# EAGLE design PiedPiper (EAGLE 9.5.1)
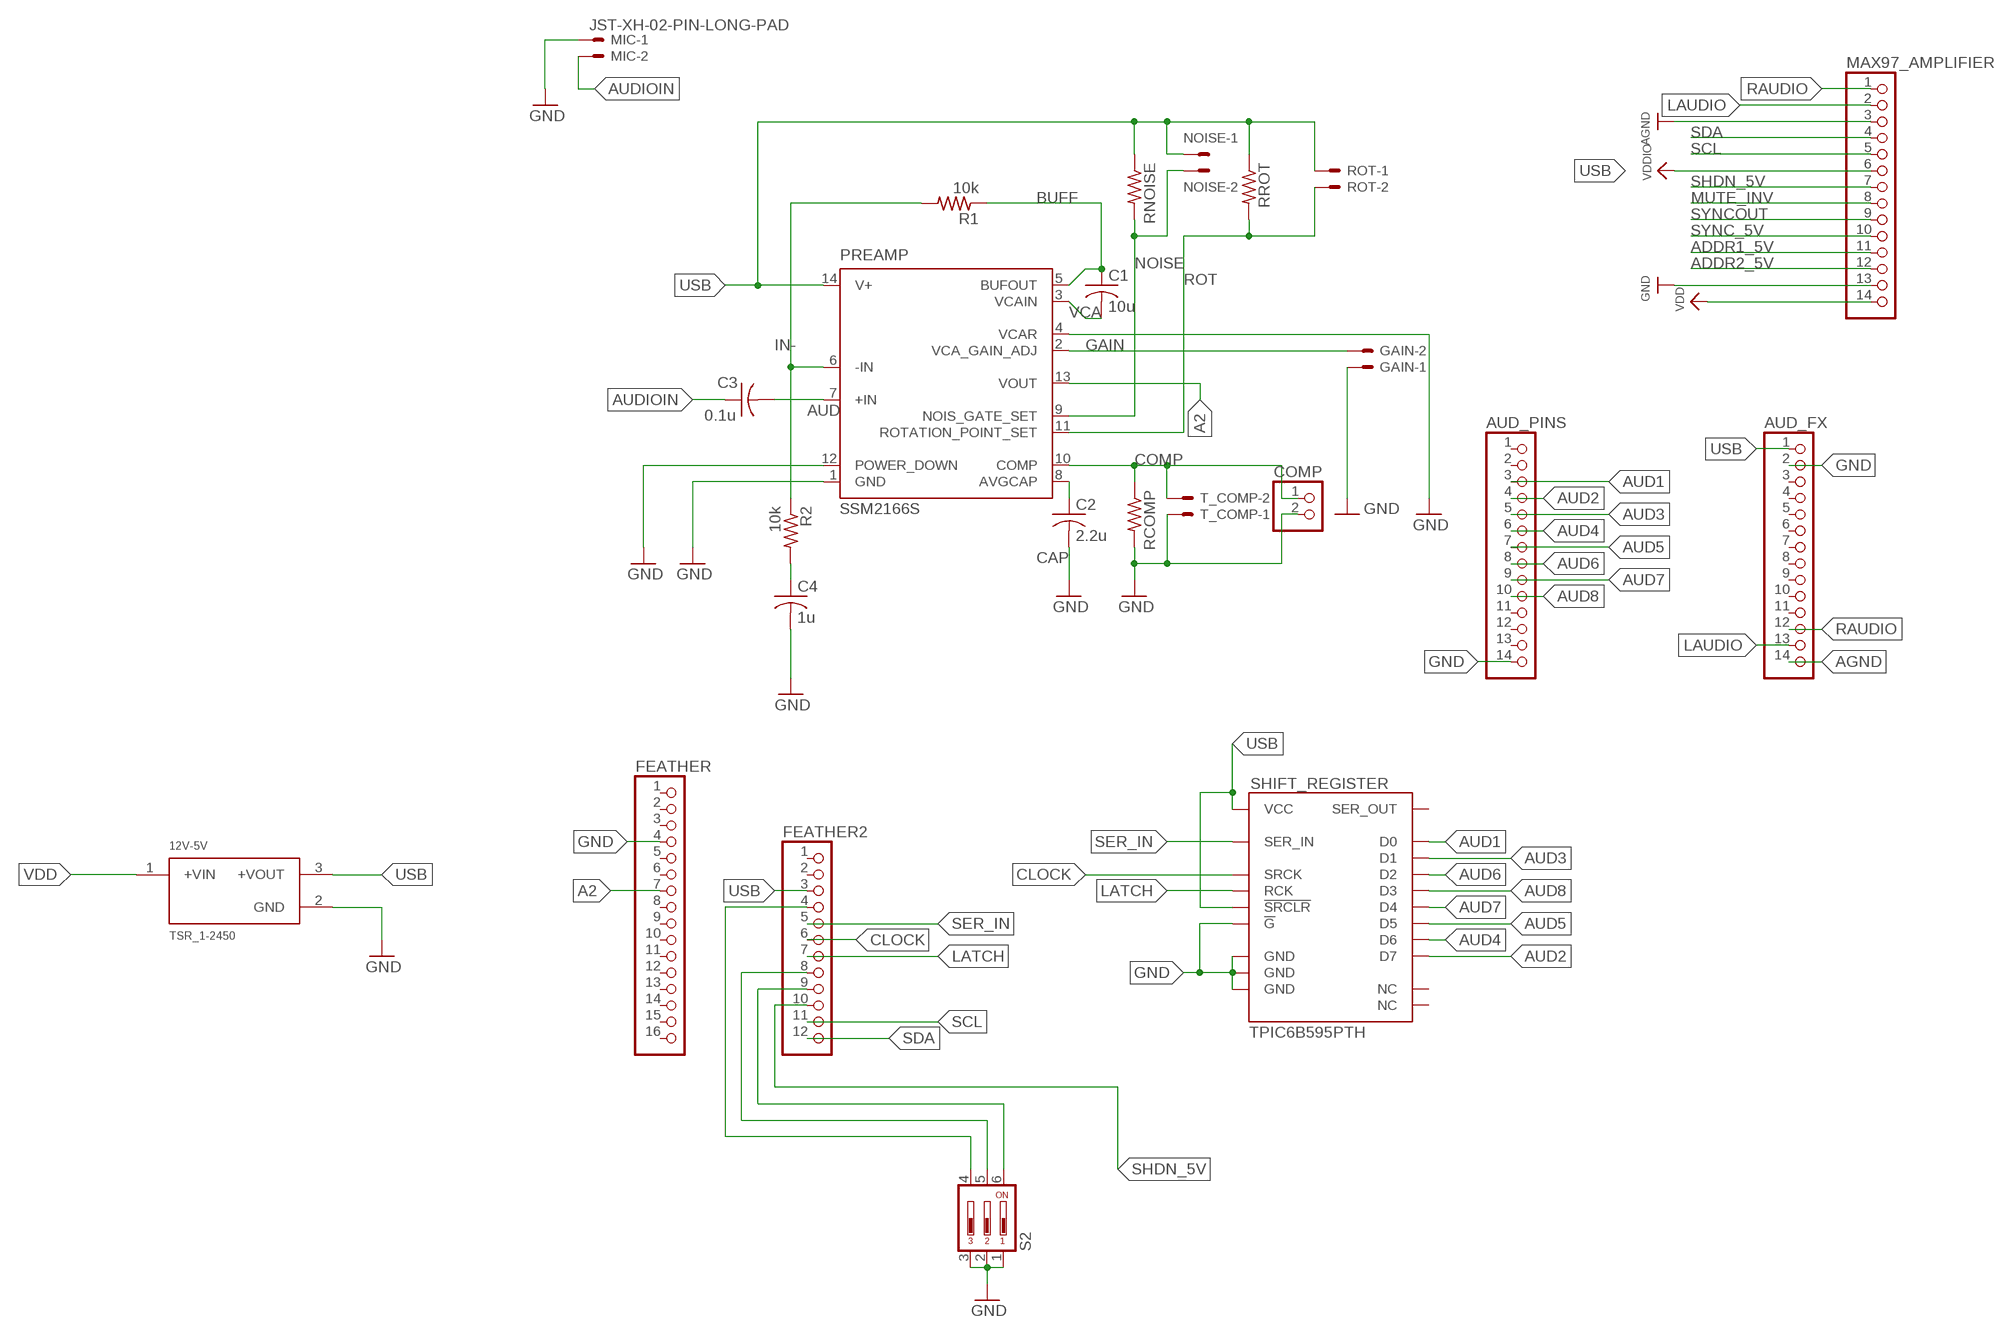
[diagram p0: schematic, sheet 1]

## Parts
12V-5V  TSR_1-2450  [CONV_TSR_1-2450]
AUD_FX  PINHD-1X14  [1X14]
AUD_PINS  PINHD-1X14  [1X14]
C1  10u  C-USC0805  [C0805]
C2  2.2u  C-USC0805  [C0805]
C3  0.1u  C-USC0805  [C0805]
C4  1u  C-USC0805  [C0805]
COMP  PINHD-1X2  [1X02]
FEATHER  PINHD-1X16  [1X16]
FEATHER2  PINHD-1X12  [1X12]
GAIN  JST-XH-02-PIN-LONG-PAD  [JST-XH-02-PACKAGE-LONG-PAD]
MAX97_AMPLIFIER  HEADER-1X14  [1X14_ROUND70]
MIC  JST-XH-02-PIN-LONG-PAD  [JST-XH-02-PACKAGE-LONG-PAD]
NOISE  JST-XH-02-PIN-LONG-PAD  [JST-XH-02-PACKAGE-LONG-PAD]
PREAMP  SSM2166S  [SO14]
R1  10k  R-US_R1206  [R1206]
R2  10k  R-US_R1206  [R1206]
RCOMP  R-US_R1206  [R1206]
RNOISE  R-US_R1206  [R1206]
ROT  JST-XH-02-PIN-LONG-PAD  [JST-XH-02-PACKAGE-LONG-PAD]
RROT  R-US_R1206  [R1206]
S2  DP03  [DP-03]
SHIFT_REGISTER  TPIC6B595PTH  [DIL20]
T_COMP  JST-XH-02-PIN-LONG-PAD  [JST-XH-02-PACKAGE-LONG-PAD]

## Nets
A2: FEATHER.7 PREAMP.13(VOUT)
ADDR1_5V: MAX97_AMPLIFIER.11
ADDR2_5V: MAX97_AMPLIFIER.12
AGND: AUD_FX.14 MAX97_AMPLIFIER.3
AUD: C3.2 PREAMP.7(+IN)
AUD1: AUD_PINS.3 SHIFT_REGISTER.4(D0)
AUD2: AUD_PINS.4 SHIFT_REGISTER.17(D7)
AUD3: AUD_PINS.5 SHIFT_REGISTER.5(D1)
AUD4: AUD_PINS.6 SHIFT_REGISTER.16(D6)
AUD5: AUD_PINS.7 SHIFT_REGISTER.15(D5)
AUD6: AUD_PINS.8 SHIFT_REGISTER.6(D2)
AUD7: AUD_PINS.9 SHIFT_REGISTER.14(D4)
AUD8: AUD_PINS.10 SHIFT_REGISTER.7(D3)
AUDIOIN: C3.1 MIC.2
BUFF: C1.1 PREAMP.5(BUFOUT) R1.1
CAP: C2.1 PREAMP.8(AVGCAP)
CLOCK: FEATHER2.6 SHIFT_REGISTER.13(SRCK)
COMP: COMP.1 PREAMP.10(COMP) RCOMP.1 T_COMP.2
GAIN: GAIN.2 PREAMP.2(VCA_GAIN_ADJ)
GND: 12V-5V.2(GND) AUD_FX.2 AUD_PINS.14 C2.2 C4.2 COMP.2 FEATHER.4 GAIN.1 MAX97_AMPLIFIER.13 MIC.1 PREAMP.1(GND) PREAMP.4(VCAR) PREAMP.12(POWER_DOWN) RCOMP.2 S2.1 S2.2 S2.3 SHIFT_REGISTER.9(!G) SHIFT_REGISTER.10(GND) SHIFT_REGISTER.11(GND) SHIFT_REGISTER.19(GND) T_COMP.1
IN-: PREAMP.6(-IN) R1.2 R2.1
LATCH: FEATHER2.7 SHIFT_REGISTER.12(RCK)
LAUDIO: AUD_FX.13 MAX97_AMPLIFIER.2
MUTE_INV: MAX97_AMPLIFIER.8
N$1: FEATHER2.8 S2.5
N$3: FEATHER2.9 S2.6
N$4: FEATHER2.4 S2.4
N$15: C4.1 R2.2
NOISE: NOISE.2 PREAMP.9(NOIS_GATE_SET) RNOISE.2
RAUDIO: AUD_FX.12 MAX97_AMPLIFIER.1
ROT: PREAMP.11(ROTATION_POINT_SET) ROT.2 RROT.2
SCL: FEATHER2.11 MAX97_AMPLIFIER.5
SDA: FEATHER2.12 MAX97_AMPLIFIER.4
SER_IN: FEATHER2.5 SHIFT_REGISTER.3(SER_IN)
SHDN_5V: FEATHER2.10 MAX97_AMPLIFIER.7
SYNC_5V: MAX97_AMPLIFIER.10
SYNCOUT: MAX97_AMPLIFIER.9
USB: 12V-5V.3(+VOUT) AUD_FX.1 FEATHER2.3 MAX97_AMPLIFIER.6 NOISE.1 PREAMP.14(V+) RNOISE.1 ROT.1 RROT.1 SHIFT_REGISTER.2(VCC) SHIFT_REGISTER.8(!SRCLR) ; supply symbol labelled VDDIO
VCA: C1.2 PREAMP.3(VCAIN)
VDD: 12V-5V.1(+VIN) MAX97_AMPLIFIER.14
Unconnected: AUD_FX.3 AUD_FX.4 AUD_FX.5 AUD_FX.6 AUD_FX.7 AUD_FX.8 AUD_FX.9 AUD_FX.10 AUD_FX.11 AUD_PINS.1 AUD_PINS.2 AUD_PINS.11 AUD_PINS.12 AUD_PINS.13 FEATHER2.1 FEATHER2.2 FEATHER.1 FEATHER.2 FEATHER.3 FEATHER.5 FEATHER.6 FEATHER.8 FEATHER.9 FEATHER.10 FEATHER.11 FEATHER.12 FEATHER.13 FEATHER.14 FEATHER.15 FEATHER.16 SHIFT_REGISTER.1(NC) SHIFT_REGISTER.18(SER_OUT) SHIFT_REGISTER.20(NC)

## Library data of the parts
12V-5V = TSR_1-2450:TSR_1-2450: Linear Regulator Replacement DC DC Converter 1 Output 12V 1A 15V - 36V Input; AVAILABILITY: Unavailable; DESCRIPTION: Linear Regulator Replacement DC DC Converter 1 Output 5V 1A 6.5V - 36V Input; MF: Traco Power; MP: TSR 1-2450; PACKAGE: SIP-3 Tracopower; PRICE: None
AUD_FX AUD_PINS = pinhead:PINHD-1X14: PIN HEADER
C1-C4 = rcl:C-US: CAPACITOR, American symbol; SPICEPREFIX: C
COMP = pinhead:PINHD-1X2: PIN HEADER
FEATHER = pinhead:PINHD-1X16: PIN HEADER
FEATHER2 = pinhead:PINHD-1X12: PIN HEADER
GAIN MIC NOISE ROT T_COMP = Rembrandt Electronics - JST XH Connectors v1-0:JST-XH-02-PIN: JST XH Connector 2 Pin Wire to board connector. Pitch: 2,54 mm, (0.100") Number of pins: 2 Created by Rembrandt Electronics www.rembrandtelectronics.com
MAX97_AMPLIFIER = microbuilder:HEADER-1X14
PREAMP = SSM2166:SSM2166: Microphone Preamplifier with Variable Compression and Noise Gating Source: http://www.analog.com/static/imported-files/data_sheets/SSM2166.pdf; AVAILABILITY: Unavailable; DESCRIPTION: ADI MICROPHONE PREAMP W/VAR COMPRESS; MF: Analog Devices; MP: SSM2166; PACKAGE: None; PRICE: None
R1 R2 RCOMP RNOISE RROT = rcl:R-US_: RESISTOR, American symbol; SPICEPREFIX: R
S2 = switch-dil:DP03: DIL/CODE SWITCH; MPN: MCDP03; OC_FARNELL: 1522004; OC_NEWARK: 74M2976
SHIFT_REGISTER = TPIC6B595:TPIC6B595; AVAILABILITY: Unavailable; DESCRIPTION: Integrated Circuit; MF: Texas Instruments; MP: TPIC6B595; PACKAGE: SOIC-20 Texas Instruments; PRICE: None

## Board
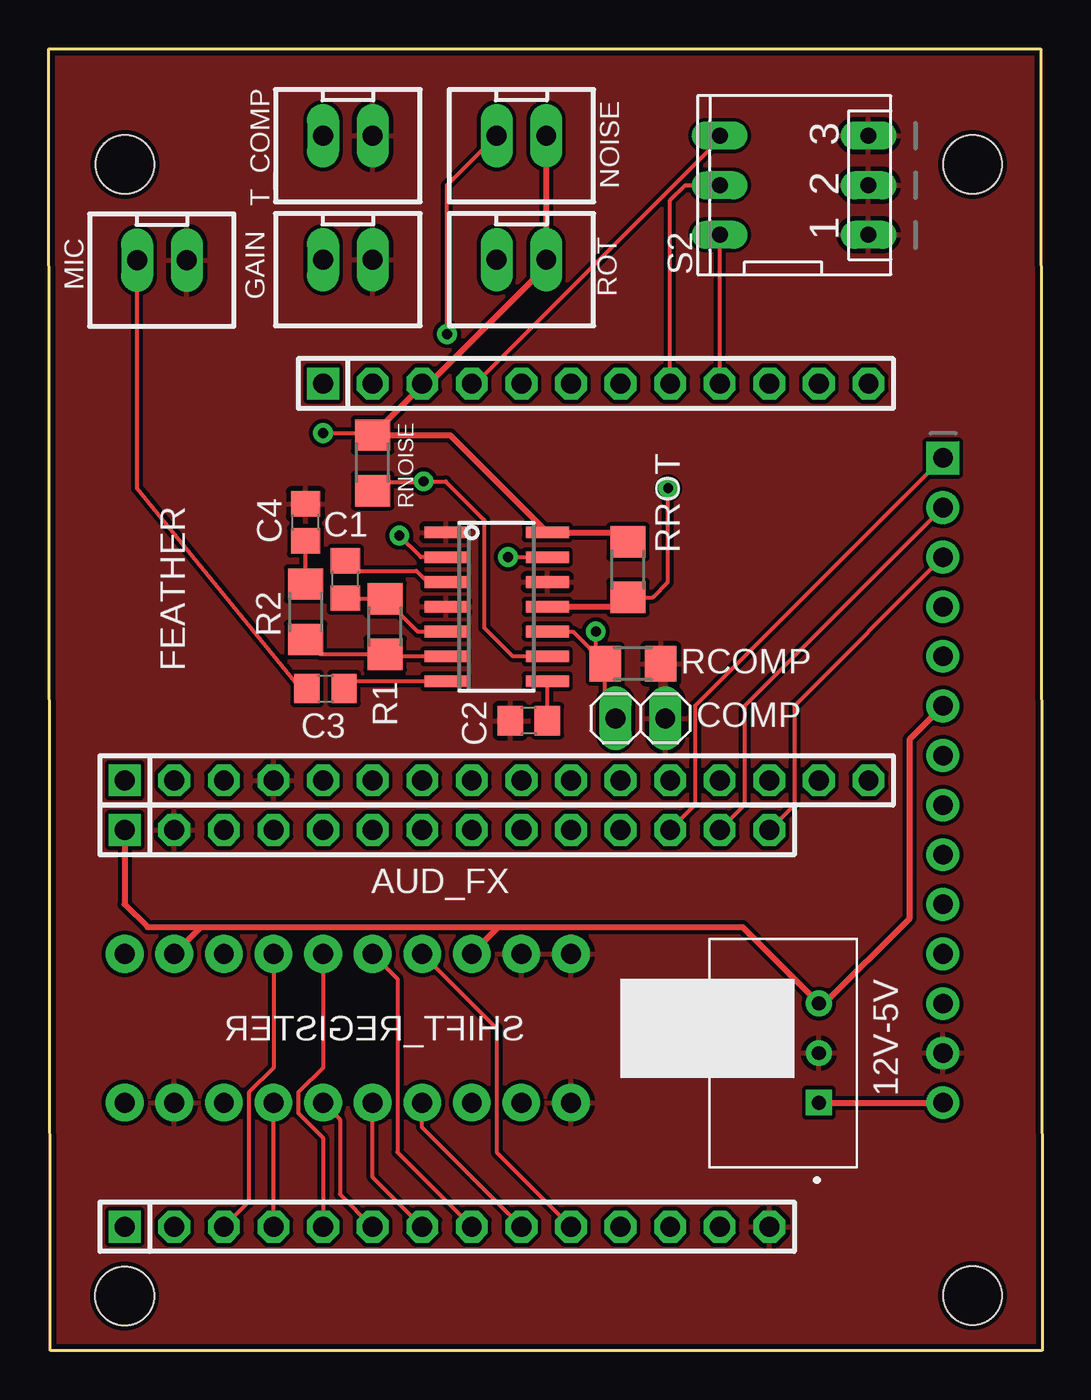
[diagram p1: board, top side]
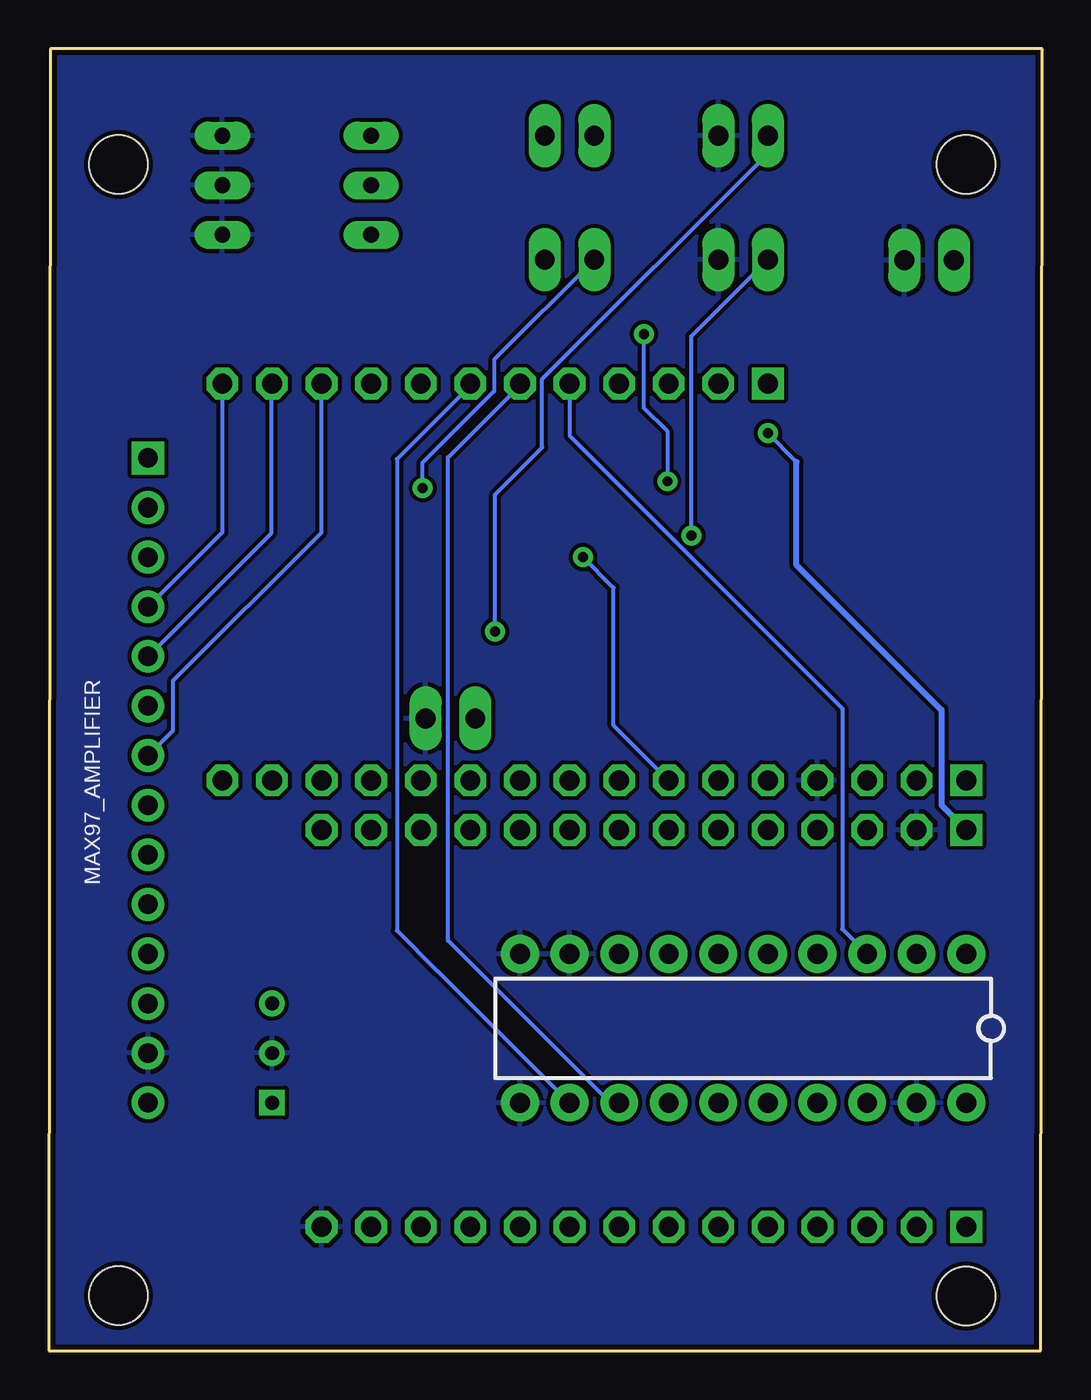
[diagram p2: board, bottom side, seen from below]

Size 50.88 x 66.68 mm. Coordinates in mm from the lower left corner, seen from the top.
Outline: 0,66.68 50.8,66.68 50.88,0 0.08,0 0,66.68
Copper layers (1*16): Top 0.035mm / dielectric 1.5mm / Bottom 0.035mm
Design rules "SparkFun": minimum track width 8mil, minimum drill 20mil, track to track 8mil, track to pad 8mil, pad to pad 8mil, via to via 8mil, smd to smd 8mil, copper to edge 10mil, drill to drill 8mil, minimum pad ring 12mil, minimum via ring 10mil, stop-mask expansion 4mil, vias tented up to drill 25mil, thermal gap 10mil
Holes 3 mm at 47.32,2.82 3.89,2.79 3.9,60.76 47.31,60.75

### Footprints (pad centres in the part's own frame; a part is rotated, then mirrored left to right if it is on the bottom)
CONV_TSR_1-2450 = drill 0.71 pad 1.11 square: 1 -2.54,0 | drill 0.71 pad 1.11: 2 0,0; 3 2.54,0
1X14 = drill 1.016 square: 1 -16.51,0 | drill 1.016 octagon: 2 -13.97,0; 3 -11.43,0; 4 -8.89,0; 5 -6.35,0; 6 -3.81,0; 7 -1.27,0; 8 1.27,0; 9 3.81,0; 10 6.35,0; 11 8.89,0; 12 11.43,0; 13 13.97,0; 14 16.51,0
C0805 = smd 1.3 x 1.5: 1 -0.95,0; 2 0.95,0
1X02 = drill 1.016 long: 1 -1.27,0; 2 1.27,0
1X16 = drill 1.016 square: 1 -19.05,0 | drill 1.016 octagon: 2 -16.51,0; 3 -13.97,0; 4 -11.43,0; 5 -8.89,0; 6 -6.35,0; 7 -3.81,0; 8 -1.27,0; 9 1.27,0; 10 3.81,0; 11 6.35,0; 12 8.89,0; 13 11.43,0; 14 13.97,0; 15 16.51,0; 16 19.05,0
1X12 = drill 1.016 square: 1 -13.97,0 | drill 1.016 octagon: 2 -11.43,0; 3 -8.89,0; 4 -6.35,0; 5 -3.81,0; 6 -1.27,0; 7 1.27,0; 8 3.81,0; 9 6.35,0; 10 8.89,0; 11 11.43,0; 12 13.97,0
JST-XH-02-PACKAGE-LONG-PAD = drill 1.016 long: 1 -1.27,0; 2 1.27,0
1X14_ROUND70 = drill 1 pad 1.676 square: 1 -16.51,0 | drill 1 pad 1.676: 2 -13.97,0; 3 -11.43,0; 4 -8.89,0; 5 -6.35,0; 6 -3.81,0; 7 -1.27,0; 8 1.27,0; 9 3.81,0; 10 6.35,0; 11 8.89,0; 12 11.43,0; 13 13.97,0; 14 16.51,0
SO14 = smd 0.6 x 2.2: 1 -3.81,-2.6; 2 -2.54,-2.6; 3 -1.27,-2.6; 4 0,-2.6; 5 1.27,-2.6; 6 2.54,-2.6; 7 3.81,-2.6; 8 3.81,2.6; 9 2.54,2.6; 10 1.27,2.6; 11 0,2.6; 12 -1.27,2.6; 13 -2.54,2.6; 14 -3.81,2.6
R1206 = smd 1.6 x 1.803: 1 -1.422,0; 2 1.422,0
DP-03 = drill 0.813 long: 1 -2.54,-3.81; 2 0,-3.81; 3 2.54,-3.81; 4 2.54,3.81; 5 0,3.81; 6 -2.54,3.81
DIL20 = drill 1.016 pad 1.93: 1 -11.43,-3.81; 2 -8.89,-3.81; 3 -6.35,-3.81; 4 -3.81,-3.81; 5 -1.27,-3.81; 6 1.27,-3.81; 7 3.81,-3.81; 8 6.35,-3.81; 9 8.89,-3.81; 10 11.43,-3.81; 11 11.43,3.81; 12 8.89,3.81; 13 6.35,3.81; 14 3.81,3.81; 15 1.27,3.81; 16 -1.27,3.81; 17 -3.81,3.81; 18 -6.35,3.81; 19 -8.89,3.81; 20 -11.43,3.81

### Placement (x,y rotation side)
12V-5V  39.45,15.24 90 top
AUD_FX  20.4,26.67 0 top
AUD_PINS  20.4,6.35 0 top
C1  15.19,39.5 90 top
C2  24.59,32.26 180 top
C3  14.17,33.91 0 top
C4  13.16,42.42 90 top
COMP  30.3,32.38 0 top
FEATHER  22.94,29.21 0 top
FEATHER2  28.02,49.53 0 top
GAIN  15.32,55.88 180 top
MAX97_AMPLIFIER  45.8,29.21 270 top
MIC  5.79,55.85 180 top
NOISE  24.21,62.23 180 top
PREAMP  22.94,38.1 270 top
R1  17.22,37.08 270 top
R2  13.16,37.85 90 top
RCOMP  29.92,35.18 0 top
RNOISE  16.59,45.47 270 top
ROT  24.21,55.88 180 top
RROT  29.67,40.01 270 top
S2  38.18,59.69 90 top
SHIFT_REGISTER  15.32,16.51 180 bottom
T_COMP  15.32,62.23 180 top

### Tracks (layer width: path | path; a pad name or v marks a point on that pad's centre or on a via)
A2  (via drill 0.51)
  Top 0.203: v23.52,40.64 PREAMP.13
  Bottom 0.203: FEATHER.7 21.95,32.03 21.95,39.07 v23.52,40.64
AGND
  Top 0.203: AUD_FX.14 38.18,27.94 38.18,33.02 MAX97_AMPLIFIER.3
AUD
  Top 0.203: C3.2 15.12,34.16 15,34.29 PREAMP.7
AUD1
  Top 0.203: SHIFT_REGISTER.4 11.51,14.5 10.24,13.23 10.24,7.62 AUD_PINS.3
AUD2
  Top 0.203: AUD_PINS.4 SHIFT_REGISTER.17
AUD3
  Top 0.203: SHIFT_REGISTER.5 14.05,14.5 12.78,13.23 12.78,12.17 14.05,10.9 AUD_PINS.5
AUD4
  Top 0.203: SHIFT_REGISTER.16 14.91,11.84 14.91,8.01 16.57,6.35 AUD_PINS.6
AUD5
  Top 0.203: AUD_PINS.7 16.59,8.89 SHIFT_REGISTER.15
AUD6
  Top 0.203: SHIFT_REGISTER.6 17.86,19.05 17.86,10.16 AUD_PINS.8
AUD7
  Top 0.203: AUD_PINS.9 19.13,11.43 SHIFT_REGISTER.14
AUD8
  Top 0.203: SHIFT_REGISTER.7 22.94,16.51 22.94,10.16 AUD_PINS.10
AUDIOIN
  Top 0.203: C3.1 13.19,33.55 4.52,44.16 MIC.2
BUFF
  Top 0.203: PREAMP.5 18.9,36.83 R1.1 15.23,38.51 C1.1
CAP
  Top 0.203: C2.1 PREAMP.8
CLOCK
  Bottom 0.203: SHIFT_REGISTER.13 22.12,12.7 30.43,21.01 30.43,45.74 26.75,49.43 FEATHER2.6
COMP  (via drill 0.51)
  Top 0.203: PREAMP.10 26.85,36.83 RCOMP.1 | COMP.1 28.5,32.92 RCOMP.1 | RCOMP.1 28.02,35.66 v28.02,36.83
  Bottom 0.203: T_COMP.2 14.05,61.3 25.6,49.75 25.6,46.25 28.02,43.84 v28.02,36.83
GAIN  (via drill 0.51)
  Top 0.203: PREAMP.2 19.07,40.64 v17.95,41.75
  Bottom 0.203: GAIN.2 17.98,51.94 17.98,41.78 v17.95,41.75
GND
  pour Top: 0.08,0 51.26,0 51.26,66.93 0.08,66.93
  pour Bottom: 0.08,0 0.08,66.8 51.26,66.8 51.26,0
IN-
  Top 0.203: PREAMP.6 17.32,35.56 R1.2 13.92,35.66 R2.1
LATCH
  Bottom 0.203: SHIFT_REGISTER.12 30.92,19.41 30.94,19.41 33.05,21.52 33.05,45.67 29.29,49.43 FEATHER2.7
LAUDIO
  Top 0.203: AUD_FX.13 35.64,27.94 35.64,33.02 MAX97_AMPLIFIER.2
N$1
  Top 0.203: FEATHER2.8 31.83,58.92 32.6,59.69 S2.5
N$3
  Top 0.203: FEATHER2.9 S2.6
N$4
  Top 0.203: FEATHER2.4 21.86,49.53 34.37,62.04 S2.4
N$15
  Top 0.203: R2.2 C4.1
NOISE  (via drill 0.51)
  Top 0.203: PREAMP.9 23.78,35.56 22.3,37.04 22.3,42.55 20.32,44.52 v19.2,44.52 19.13,44.45 16.59,44.45 RNOISE.2 | NOISE.2 20.4,59.69 v20.4,52.07
  Bottom 0.203: v19.2,44.52 19.2,47.09 20.4,48.28 v20.4,52.07
RAUDIO
  Top 0.203: AUD_FX.12 33.1,27.94 33.1,33.02 MAX97_AMPLIFIER.1
ROT  (via drill 0.51)
  Top 0.203: RROT.2 30.94,38.58 31.7,39.35 31.7,44.15 v31.72,44.17
  Top 0.305: PREAMP.11 29.29,38.1 29.77,38.58 RROT.2
  Bottom 0.203: ROT.2 28.07,50.75 28.07,49.13 31.75,45.45 31.75,44.2 v31.72,44.17
SCL
  Bottom 0.203: MAX97_AMPLIFIER.5 39.5,41.86 39.5,49.48 FEATHER2.11
SDA
  Bottom 0.203: MAX97_AMPLIFIER.4 41.99,41.91 FEATHER2.12
SER_IN
  Bottom 0.203: FEATHER2.5 24.21,46.86 10.24,32.89 10.24,21.59 SHIFT_REGISTER.3
SHDN_5V
  Bottom 0.203: MAX97_AMPLIFIER.7 44.53,31.75 44.53,34.29 36.91,41.91 FEATHER2.10
USB  (via drill 0.51)
  Top 0.203: v14.05,46.99 16.48,46.99
  Top 0.305: RNOISE.1 20.56,46.89 PREAMP.14 29.18,41.91 RROT.1 | RNOISE.1 19.13,49.43 FEATHER2.3 19.48,49.53 25.48,55.52 ROT.1 NOISE.1 | AUD_FX.1 3.89,22.86 5.05,21.69 7.7,21.69 | RNOISE.1 16.48,46.99 | 7.7,21.69 23.04,21.69 | 23.04,21.69 35.53,21.69 12V-5V.3 39.73,17.78 44.09,22.15 44.09,31.32 MAX97_AMPLIFIER.6 | SHIFT_REGISTER.8 23.04,21.69 | SHIFT_REGISTER.2 7.7,21.59 7.7,21.69
  Bottom 0.203: 12.57,45.52 v14.05,46.99
  Bottom 0.305: AUD_FX.1 5.16,27.94 5.16,32.82 12.57,40.23 12.57,45.52
VCA
  Top 0.203: PREAMP.3 19.4,39.37 18.83,39.94 15.7,39.94 C1.2
VDD
  Top 0.305: 12V-5V.1 MAX97_AMPLIFIER.14